# EAGLE design JDA Compact Switch D2PAK V1 (EAGLE 7.6.0)
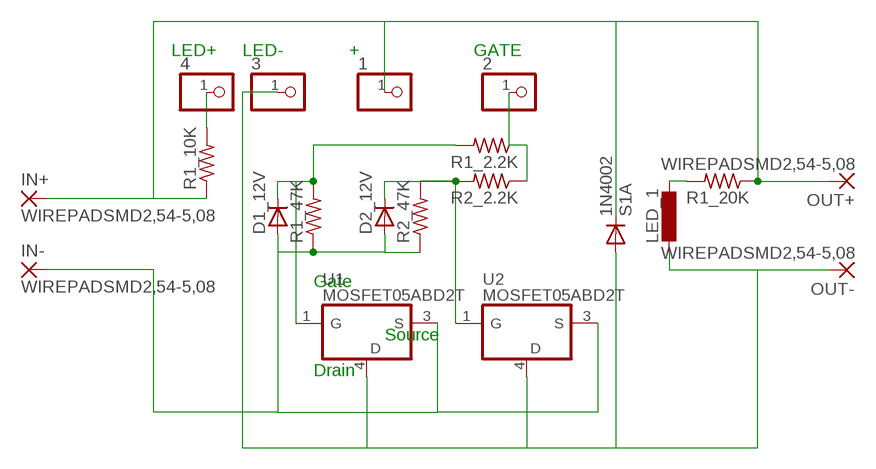
[diagram p0: schematic, sheet 1]

## Parts
1  PINHD-1X1  [1X01]
1N4002  S1A  [DO214AC]
2  PINHD-1X1  [1X01]
3  PINHD-1X1  [1X01]
4  PINHD-1X1  [1X01]
D1_12V  D-SOD-80  [SOD80]
D2_12V  D-SOD-80  [SOD80]
IN+  WIREPADSMD2,54-5,08  [SMD2,54-5,08]
IN-  WIREPADSMD2,54-5,08  [SMD2,54-5,08]
LED_1  L-EUL0805  [L0805]
OUT+  WIREPADSMD2,54-5,08  [SMD2,54-5,08]
OUT-  WIREPADSMD2,54-5,08  [SMD2,54-5,08]
R1_2.2K  R-US_M1206  [M1206]
R1_10K  R-US_M1206  [M1206]
R1_20K  R-US_R1206  [R1206]
R1_47K  R-US_M1206  [M1206]
R2_2.2K  R-US_M1206  [M1206]
R2_47K  R-US_M1206  [M1206]
U1  MOSFET05ABD2T  [D2PAK-3]
U2  MOSFET05ABD2T  [D2PAK-3]

## Nets
N$1: LED_1.1 R1_20K.2
N$2: 4.1 R1_10K.2
N$3: D2_12V.C R2_2.2K.2 R2_47K.2 U2.1(G)
N$4: 1.1 1N4002.C IN+.1(P) OUT+.1(P) R1_10K.1 R1_20K.1
N$5: 2.1 R1_2.2K.1 R2_2.2K.1
N$7: D1_12V.C R1_2.2K.2 R1_47K.2 U1.1(G)
N$77: 1N4002.A 3.1 LED_1.2 OUT-.1(P) U1.4(GND) U2.4(GND)
S: D1_12V.A D2_12V.A IN-.1(P) R1_47K.1 R2_47K.1 U1.3(S) U2.3(S)

## Notes on the sheet
- LED+ | LED- | + | GATE
- Gate
- Source
- Drain

## Library data of the parts
1-4 = pinhead:PINHD-1X1: PIN HEADER
1N4002 = s1x_10:S1*: S1A - S1M General Purpose Rectifiers Source: http://www.fairchildsemi.com/datasheets/S1/S1A.pdf; MF: Fairchild; MPN: S1A; OC_FARNELL: 9843868; OC_NEWARK: 58K9551
D1_12V D2_12V = diodes:D-: DIODE
IN+ IN- OUT+ OUT- = wirepad:WIREPAD: Wire PAD connect wire on PCB
LED_1 = rcl (2):L-EU: INDUCTOR, European symbol
R1_2.2K R1_10K R1_47K R2_2.2K R2_47K = resistor:R-US_: RESISTOR, American symbol
R1_20K = rcl:R-US_: RESISTOR, American symbol
U1 U2 = _hhn_78xx_79xx_NCV78xx_d2pak_dpak:MOSFET: 78xx SMD (D2PAK, DPAK) (MC)78xx..DT (DPAK-3; Rth,JA = 92 K/W) (MC)78xx..D2T (D2PAK-3; Rth,JA = 45 K/W @ 10x10mm copper area) Linear Voltage Regulators, Positive, 1 A (ON Semiconductor) Package dimenisions and soldering footprints acc. to ONSEMI specs. Source: http://onsemi.com Datasheet document#: MC7800/D Technologies: 78xxyD(2)Tz: xx = Output Voltage (V) y, z: additional suffixes see manufacturer's datasheet Author: Dipl.-Ing. FH Rainer Bayer HHN Hochschule Heilbronn, rainer.bayer@hs-heilbronn.de Ingenieurbüro ing-rb, mail@ing-rb.de

## Board
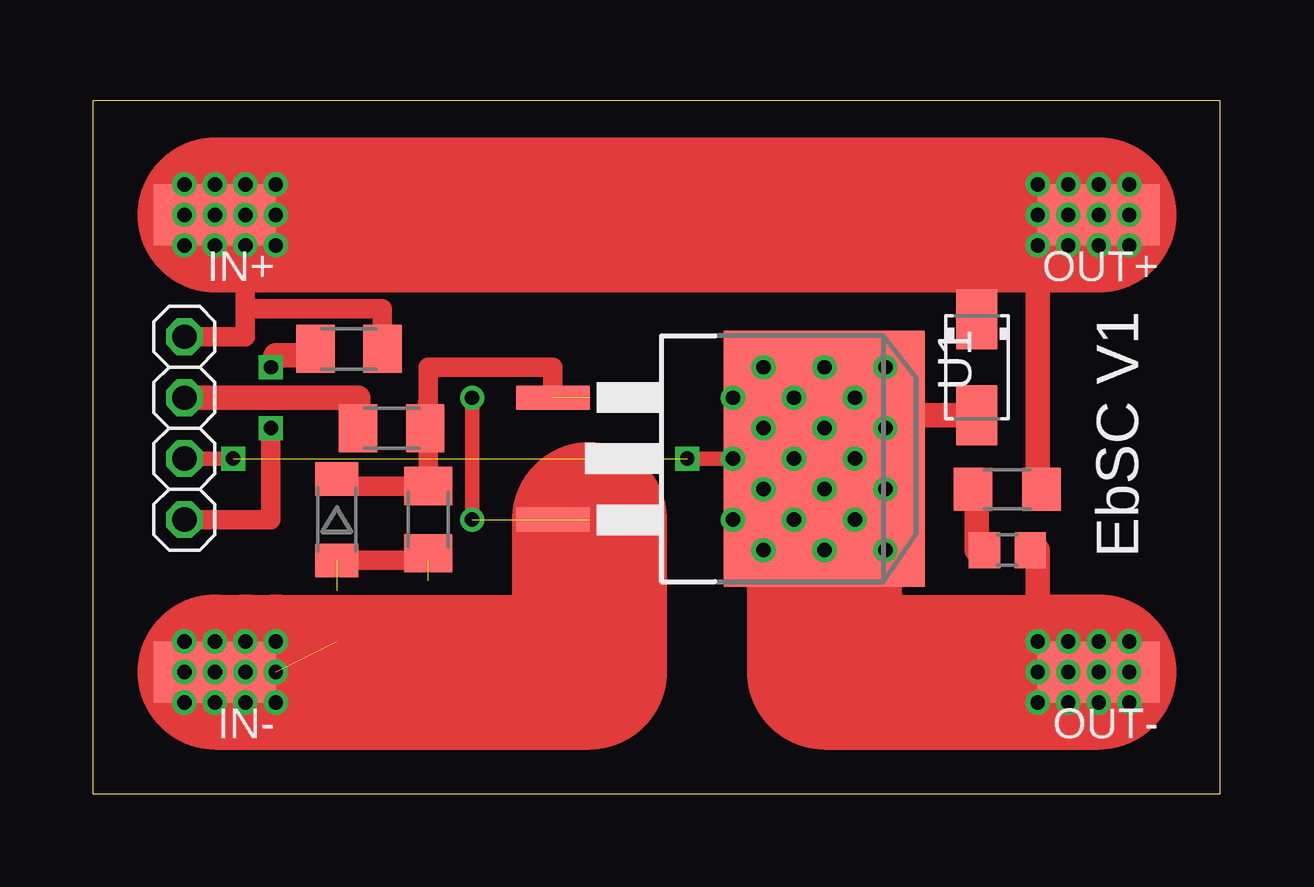
[diagram p1: board, top side]
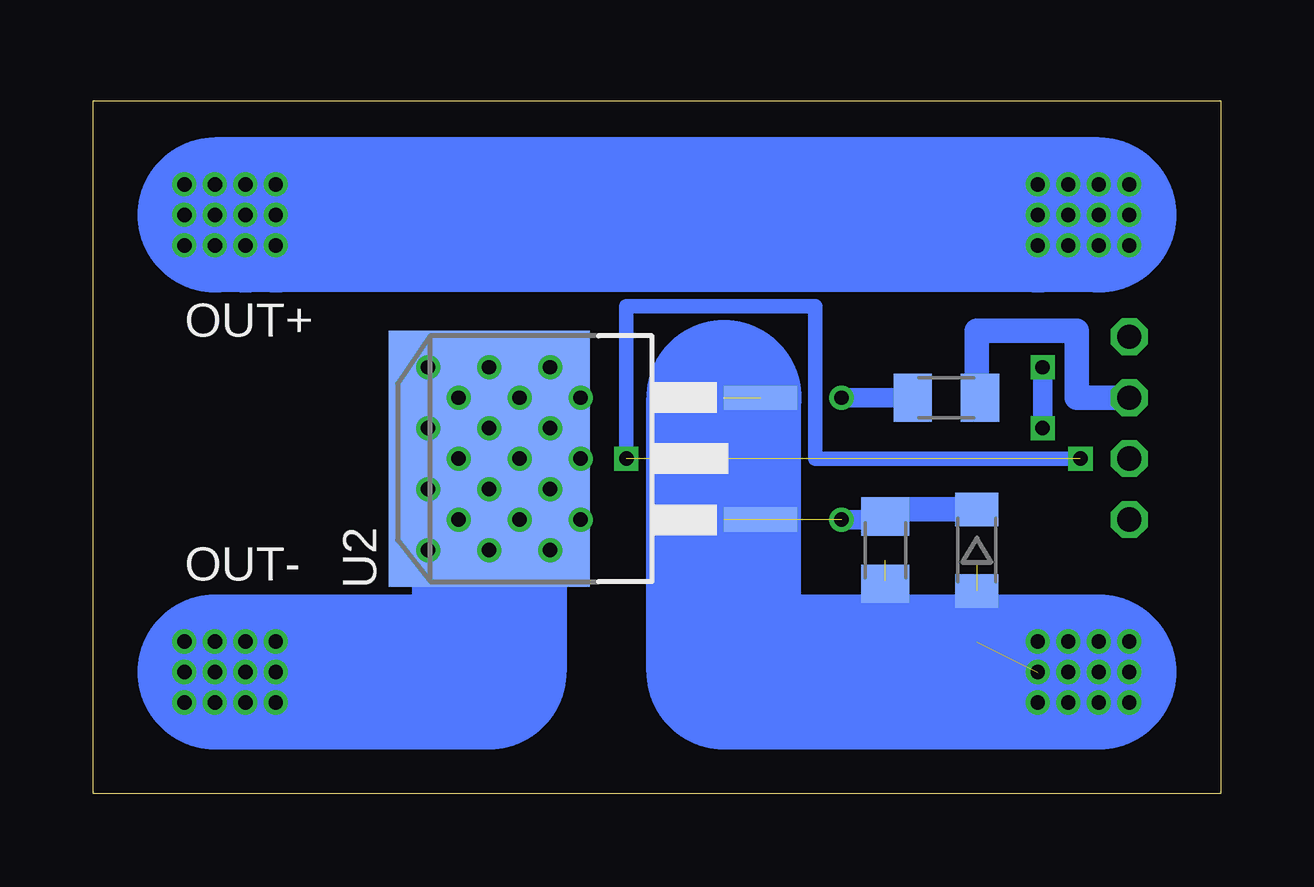
[diagram p2: board, bottom side, seen from below]

Size 46.97 x 28.88 mm. Coordinates in mm from the lower left corner, seen from the top.
Outline: 0,0 46.97,0 46.97,28.88 0,28.88 0,0
Copper layers (1*16): Top 0.035mm / dielectric 1.5mm / Bottom 0.035mm
Design rules "default": minimum track width 10mil, minimum drill 24mil, track to track 8mil, track to pad 8mil, pad to pad 8mil, via to via 8mil, smd to smd 8mil, copper to edge 40mil, drill to drill 8mil, minimum pad ring 10mil, minimum via ring 8mil, stop-mask expansion 4mil, vias tented up to drill 0mil, thermal gap 10mil

### Footprints (pad centres in the part's own frame; a part is rotated, then mirrored left to right if it is on the bottom)
1X01 = drill 1.016 octagon: 1 0,0
DO214AC = smd 2.5 x 1.7: A 2,0; C -2,0
SOD80 = smd 1.4 x 1.8: A 1.7,0; C -1.7,0
SMD2,54-5,08 = smd 2.54 x 5.08: 1 0,0
L0805 = smd 1.3 x 1.5: 1 -0.95,0; 2 0.95,0
M1206 = smd 1.6 x 2: 1 -1.4,0; 2 1.4,0
R1206 = smd 1.6 x 1.803: 1 -1.422,0; 2 1.422,0
D2PAK-3 = smd 1.016 x 3.05: 1 -2.54,-11.31; 3 2.54,-11.31 | smd 10.66 x 8.38: 4 0,0

### Placement (x,y rotation side)
1  3.81,19.05 0 top
1N4002  36.83,17.78 270 top
2  3.81,16.51 0 top
3  3.81,13.97 0 top
4  3.81,11.43 0 top
D1_12V  10.16,11.43 270 top
D2_12V  10.16,10.16 270 bottom
IN+  5.08,24.13 90 top
IN-  5.08,5.08 90 top
LED_1  38.1,10.16 0 top
OUT+  41.91,24.13 90 top
OUT-  41.91,5.08 90 top
R1_2.2K  12.45,15.24 0 top
R1_10K  10.67,18.54 180 top
R1_20K  38.1,12.7 180 top
R1_47K  13.97,11.43 90 top
R2_2.2K  11.43,16.51 180 bottom
R2_47K  13.97,10.16 90 bottom
U1  30.48,13.97 270 top
U2  30.48,13.97 90 bottom

### Tracks (layer width: path | path; a pad name or v marks a point on that pad's centre or on a via)
N$1
  Top 1.016: R1_20K.2 36.83,12.7 36.83,10.16 LED_1.1
N$2  (via drill 0.6)
  Top 0.813: 4.1 7.42,11.43 v7.42,15.24
  Top 1.016: v7.42,17.78 7.62,18.29 9.27,18.29 R1_10K.2
  Bottom 0.813: v7.42,15.24 v7.42,17.78
N$3  (via drill 0.6)  (1 unrouted)
  Top 0.61: v15.8,16.51 v15.8,11.43
  Bottom 0.813: R2_2.2K.2 v15.8,16.51 | v15.8,11.43 13.97,11.43 R2_47K.2
  Bottom 1.016: D2_12V.C 13.97,11.86 R2_47K.2
N$4  (via drill 0.6)
  Top 0.813: 1.1 6.35,19.05 6.35,20.22 | 6.35,20.22 12.06,20.22 R1_10K.1 | v6.35,24.13 v6.35,22.86 6.35,20.22
  Top 1.016: R1_20K.1 39.37,12.7 v39.37,24.13
  Top 1.422: 1N4002.C 36.83,24.13
  Top 6.452: IN+.1 v6.35,24.13 v7.62,24.13 36.83,24.13 v39.37,24.13 v40.64,24.13 OUT+.1
  Bottom 6.452: IN+.1 v7.62,24.13 v39.37,24.13 v40.64,24.13 OUT+.1
  other vias: 5.08,24.13 41.91,24.13
N$5
  Top 1.016: 2.1 11.05,16.51 R1_2.2K.1
  Bottom 1.016: R2_2.2K.1 10.16,16.51 10.16,19.3 5.99,19.3 5.99,16.51 2.1
N$6  (via drill 0.6)
  other vias: 3.81,24.13
N$7
  Top 0.813: 13.97,16.51 13.97,17.78 19.17,17.78 U1.1 | R1_2.2K.2 13.97,16.51 | 13.97,16.51 R1_47K.2 10.16,12.83 D1_12V.C
N$8  (via drill 0.6)
  other vias: 3.81,25.4
N$9  (via drill 0.6)
  other vias: 5.08,25.4
N$10  (via drill 0.6)
  other vias: 6.35,25.4
N$11  (via drill 0.6)
  other vias: 5.08,22.86
N$12  (via drill 0.6)
  other vias: 3.81,22.86
N$13  (via drill 0.6)
  other vias: 7.62,25.4
N$14  (via drill 0.6)
  other vias: 7.62,22.86
N$15  (via drill 0.6)
  other vias: 43.18,24.13
N$16  (via drill 0.6)
  other vias: 43.18,25.4
N$17  (via drill 0.6)
  other vias: 43.18,22.86
N$18  (via drill 0.6)
  other vias: 41.91,22.86
N$19  (via drill 0.6)
  other vias: 41.91,25.4
N$20  (via drill 0.6)
  other vias: 40.64,25.4
N$21  (via drill 0.6)
  other vias: 40.64,22.86
N$22  (via drill 0.6)
  other vias: 39.37,25.4
N$23  (via drill 0.6)
  other vias: 39.37,22.86
N$24  (via drill 0.6)
  other vias: 3.81,6.35
N$25  (via drill 0.6)
  other vias: 3.81,5.08
N$26  (via drill 0.6)
  other vias: 3.81,3.81
N$27  (via drill 0.6)
  other vias: 5.08,3.81
N$28  (via drill 0.6)
  other vias: 5.08,6.35
N$29  (via drill 0.6)
  other vias: 6.35,6.35
N$30  (via drill 0.6)
  other vias: 6.35,3.81
N$31  (via drill 0.6)
  other vias: 7.62,3.81
N$32  (via drill 0.6)
  other vias: 43.18,6.35
N$33  (via drill 0.6)
  other vias: 43.18,5.08
N$34  (via drill 0.6)
  other vias: 43.18,3.81
N$35  (via drill 0.6)
  other vias: 41.91,3.81
N$36  (via drill 0.6)
  other vias: 41.91,6.35
N$37  (via drill 0.6)
  other vias: 40.64,6.35
N$38  (via drill 0.6)
  other vias: 40.64,3.81
N$39  (via drill 0.6)
  other vias: 39.37,3.81
N$40  (via drill 0.6)
  other vias: 39.37,6.35
N$41  (via drill 0.6)
  other vias: 27.94,10.16
N$42  (via drill 0.6)
  other vias: 33.02,10.16
N$43  (via drill 0.6)
  other vias: 31.75,11.43
N$44  (via drill 0.6)
  other vias: 29.21,11.43
N$45  (via drill 0.6)
  other vias: 27.94,12.7
N$46  (via drill 0.6)
  other vias: 33.02,12.7
N$47  (via drill 0.6)
  other vias: 31.75,13.97
N$48  (via drill 0.6)
  other vias: 29.21,13.97
N$49  (via drill 0.6)
  other vias: 27.94,15.24
N$50  (via drill 0.6)
  other vias: 30.48,15.24
N$51  (via drill 0.6)
  other vias: 33.02,15.24
N$52  (via drill 0.6)
  other vias: 31.75,16.51
N$53  (via drill 0.6)
  other vias: 29.21,16.51
N$54  (via drill 0.6)
  other vias: 27.94,17.78
N$55  (via drill 0.6)
  other vias: 30.48,17.78
N$56  (via drill 0.6)
  other vias: 33.02,17.78
N$57  (via drill 0.6)
  other vias: 26.67,16.51
N$58  (via drill 0.6)
  other vias: 26.67,13.97
N$59  (via drill 0.6)
  other vias: 5.84,13.97
N$60  (via drill 0.6)
  other vias: 24.77,13.97
N$61  (via drill 0.6)
  other vias: 7.62,6.35
N$64  (via drill 0.6)
  other vias: 26.67,11.43
N$65
  Bottom 0.61: 5.84,13.97 16.89,13.97 16.89,20.32 24.77,20.32 24.77,13.97
N$77  (via drill 0.6)  (1 unrouted)
  Top 0.61: 3.1 5.84,13.97 | U2.4 24.77,13.97
  Top 1.016: LED_1.2 39.37,10.16 v39.37,5.08 | 1N4002.A 30.48,15.78 v30.48,12.7
  Top 6.452: v39.37,5.08 v40.64,5.08 OUT-.1 30.48,5.08 v30.48,10.16 v30.48,12.7 U2.4
  Bottom 6.452: U2.4 30.48,5.08 OUT-.1
  other vias: 41.91,5.08
S  (via drill 0.6)  (5 unrouted)
  Top 0.813: D1_12V.A 13.97,9.73 R1_47K.1
  Top 6.452: IN-.1 v6.35,5.08 v7.62,5.08 20.7,5.08 20.7,11.43
  Bottom 1.016: D2_12V.A 10.16,6.35 | 13.97,8.89 R2_47K.1
  Bottom 6.452: IN-.1 20.7,5.08 20.7,16.51
  other vias: 5.08,5.08

### Text on the board
tNames: EbSC V1
bNames: OUT+ | OUT-